# Altium schematic sheet POWER.SchDoc
size B; SheetNumber: 1; SheetTotal: 3
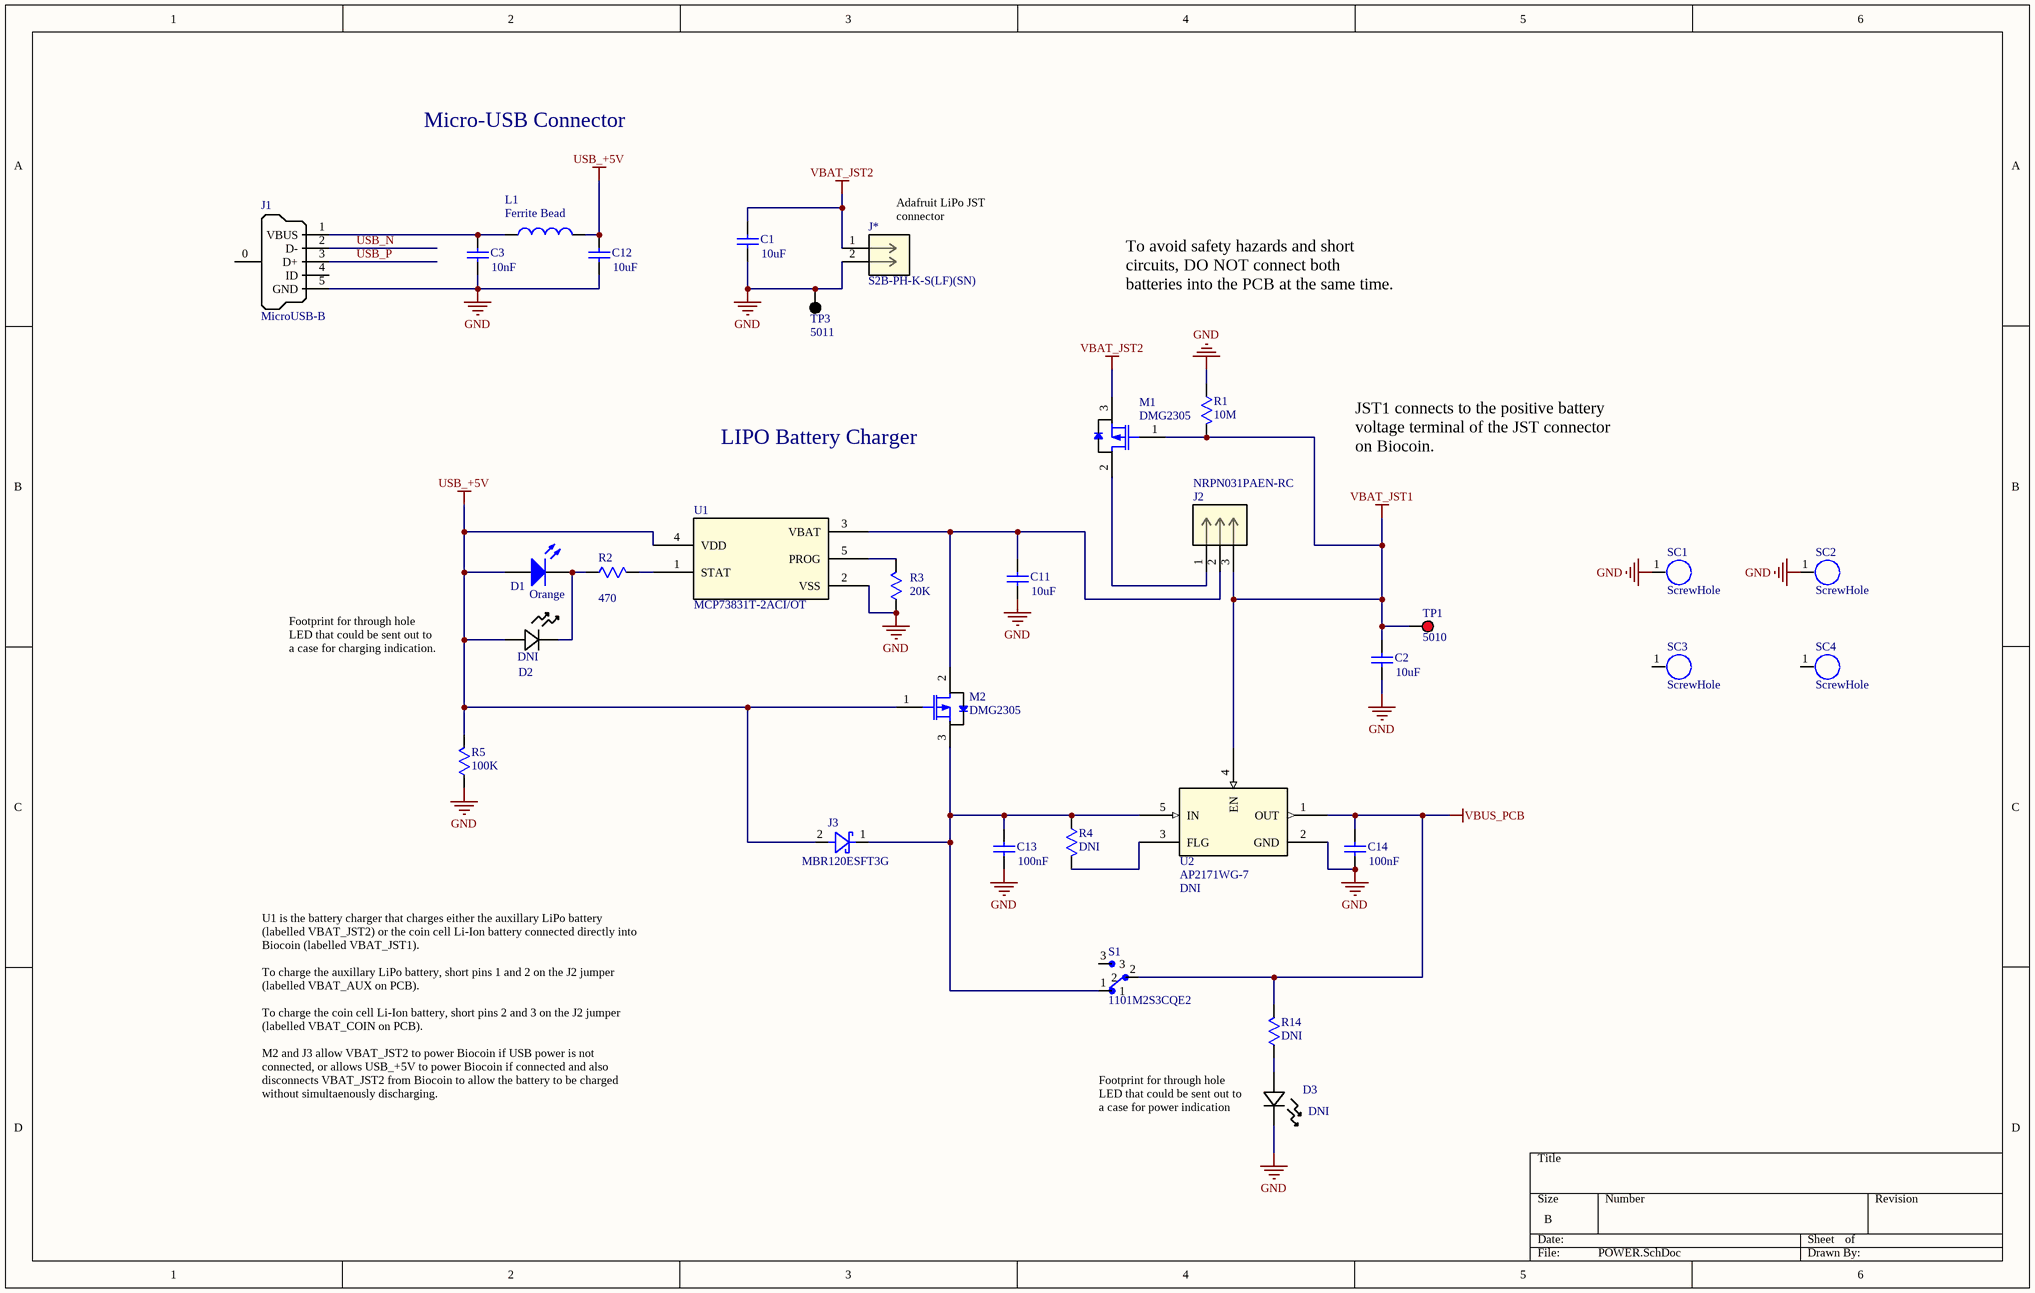
[diagram p0: POWER.SchDoc]

## Parts
C1  value 10uF  [0805-CAP]  (hidden comment: CAP)
C2  value 10uF  [0805-CAP]  (hidden comment: CAP)
C3  value 10nF  [0805-CAP]  (hidden comment: CAP)
C11  value 10uF  [0805-CAP]  (hidden comment: CAP)
C12  value 10uF  [0805-CAP]  (hidden comment: CAP)
C13  value 100nF  [0805-CAP]  (hidden comment: CAP)
C14  value 100nF  [0805-CAP]  (hidden comment: CAP)
D1  Light Color: Orange  [0805-LED]  (hidden comment: LED SMD)
D2  Do Not Install: DNI  [LED_SLI-343D_ROM]  (hidden comment: SLI-343V8RC3F)
D3  Do Not Install: DNI  [LED_SLI-343D_ROM]  (hidden comment: SLI-343V8RC3F)
J1  MicroUSB-B  [MicroUSB-B]
J2  NRPN031PAEN-RC  [CONN_NRPN031_SUL]
J3  MBR120ESFT3G  [SDO_SOD-123FL_ONS-L]
J*  S2B-PH-K-S(LF)(SN)  [CONN_S2B-PH-K-S_JST]
L1  value Ferrite Bead  [0805-IND]  (hidden comment: IND)
M1  DMG2305  [SOT23-3-Lead]
M2  DMG2305  [SOT23-3-Lead]
R1  value 10M  [0805-RES]  (hidden comment: RES)
R2  value 470  [0805-RES]  (hidden comment: RES)
R3  value 20K  [0805-RES]  (hidden comment: RES)
R4  value DNI  [0805-RES]  (hidden comment: RES)
R5  value 100K  [0805-RES]  (hidden comment: RES)
R14  value DNI  [0805-RES]  (hidden comment: RES)
S1  1101M2S3CQE2  [SW_1101M2S3CQE2]
SC1  ScrewHole  [ScrowHole]
SC2  ScrewHole  [ScrowHole]
SC3  ScrewHole  [ScrowHole]
SC4  ScrewHole  [ScrowHole]
TP1  5010  [KSTN-5010_V]
TP3  5011  [KSTN-5011_V]
U1  MCP73831T-2ACI/OT  [SOT23-5]
U2  AP2171WG-7  value DNI  [SOT25_DIO-M]

## Nets
GND: C1.1 C2.1 C3.1 C11.1 C12.1 C13.1 C14.1 D3.1 J1.5(GND) J*.2 R1.1 R3.1 R5.1 SC1.1 SC2.1 TP3.1 U1.2(VSS) U2.2(GND)
USB_+5V: C12.2 D1.1(A) D2.2 J3.2 L1.2 M2.1(G) R5.2 U1.4(VDD)
VBAT_JST1: C2.2 J2.3 M1.1(G) R1.2 TP1.1 U2.4(EN)
VBAT_JST2: C1.2 J*.1 M1.3(D)
VBUS_PCB: C14.2 R14.2 S1.2 U2.1(OUT)
USB_N: J1.2(D-)
USB_P: J1.3(D+)
NetC3_2: C3.2 J1.1(VBUS) L1.1
NetC11_2: C11.2 J2.2 M2.2(S) U1.3(VBAT)
NetC13_2: C13.2 J3.1 M2.3(D) R4.1 S1.1 U2.5(IN)
NetD1_2: D1.2(K) D2.1 R2.1
NetD3_2: D3.2 R14.1
NetJ2_1: J2.1 M1.2(S)
NetR2_2: R2.2 U1.1(STAT)
NetR3_2: R3.2 U1.5(PROG)
NetR4_2: R4.2 U2.3(FLG)

Not connected (* = marked no-connect by the designer): J1 0(Shell) 4(ID); S1 3; SC3 1; SC4 1

## Notes on the sheet
- Micro-USB Connector
- (near J*) Adafruit LiPo JST connector
- To avoid safety hazards and short circuits, DO NOT connect both batteries into the PCB at the same time.
- LIPO Battery Charger
- JST1 connects to the positive battery voltage terminal of the JST connector on Biocoin.
- Footprint for through hole LED that could be sent out to a case for charging indication.
- U1 is the battery charger that charges either the auxillary LiPo battery (labelled VBAT_JST2) or the coin cell Li-Ion battery connected directly into Biocoin (labelled VBAT_JST1).
  To charge the auxillary LiPo battery, short pins 1 and 2 on the J2 jumper (labelled VBAT_AUX on PCB).
  To charge the coin cell Li-Ion battery, short pins 2 and 3 on the J2 jumper (labelled VBAT_COIN on PCB).
  M2 and J3 allow VBAT_JST2 to power Biocoin if USB power is not connected, or allows USB_+5V to power Biocoin if connected and also disconnects VBAT_JST2 from Biocoin to allow the battery to be charged without simultaenously discharging.
- Footprint for through hole LED that could be sent out to a case for power indication

## Library data of the parts
C1-C3 C11-C14 = CAP SMD: Multilayer Chip Capacitor; Designer: OMIGA
D1 = LED SMD: Surface Mount Light Emitting Diode
D2 D3 = SLI-343V8RC3F: No Description Available; Vendor: ROHM Semiconductor; Built_By: EMA_Matt; SourceLibrary: Rohm_2019-09-23; Manufacturer_Part_Number: SLI-343V8RC3F; Copyright: Copyright (C) 2018 Accelerated Designs. All rights reserved; Parameter 2: *
J1 = MicroUSB-B: Conn Micro USB Type B RCP 5; Designer: OMIGA
J2 = NRPN031PAEN-RC: No Description Available; Mfr_Name: Sullins; Copyright: Copyright (C) 2022 Ultra Librarian. All rights reserved.; Manufacturer_Part_Number: NRPN031PAEN-RC; Digi-Key_Part_Number_1: S5800-03-ND; RefDes: RefDes; Type: DEV
J3 = SCHOTTKY: Diode Schottky 1A Surface Mount SOD-123FL
J* = S2B-PH-K-S(LF)(SN): Connector Header Through Hole, Right Angle 2 position 0.079" (2.00mm)
L1 = IND SMD: Surface Mount Inductor; Designer: OMIGA
M1 M2 = PMOS: P-Channel MOSFET DMG2305UX-13; Designer: OMIGA
R1-R5 R14 = RES SMD: Surface Mount Resistor; Designer: OMIGA
S1 = 1101M2S3CQE2: Slide Switch SPDT Through Hole; MF: C&K; SnapEDA_Link: https://www.snapeda.com/parts/1101M2S3CQE2/C%26K/view-part/287375/?ref=snap; MP: 1101M2S3CQE2; Value: *; Digi-Key_Part_Number: CKN5001-ND; Digi-Key_Purchase_URL: https://www.digikey.fr/product-detail/en/c-k/1101M2S3CQE2/CKN5001-ND/67042?utm_source=snapeda&utm_medium=aggregator&utm_campaign=symbol; Package: None
SC1-SC4 = ScrewHole: Scrow Hole; Designer: OMIGA
TP1 = Test Point Red: PC TEST POINT MULTIPURPOSE RED
TP3 = Test Point Black: PC TEST POINT MULTIPURPOSE BLACK
U1 = MCP73831T-2ACI/OT: Charger IC Lithium Ion/Polymer SOT-23-5
U2 = AP2171WG-7: No Description Available; Mfr_Name: Diodes Inc; Copyright: Copyright (C) 2022 Ultra Librarian. All rights reserved.; Manufacturer_Part_Number: AP2171WG-7; Digi-Key_Part_Number_1: AP2171WGDICT-ND; Digi-Key_Part_Number_2: AP2171WGDIDKR-ND; Digi-Key_Part_Number_3: AP2171WGDITR-ND; RefDes: RefDes; Type: DEV